# EAGLE design MicroBrute Noise add-on (EAGLE 7.6.0)
CNAME: Microbrute Addon; CREVISION: 2; DESIGNER: Gilberte / Mads Kjeldgaard
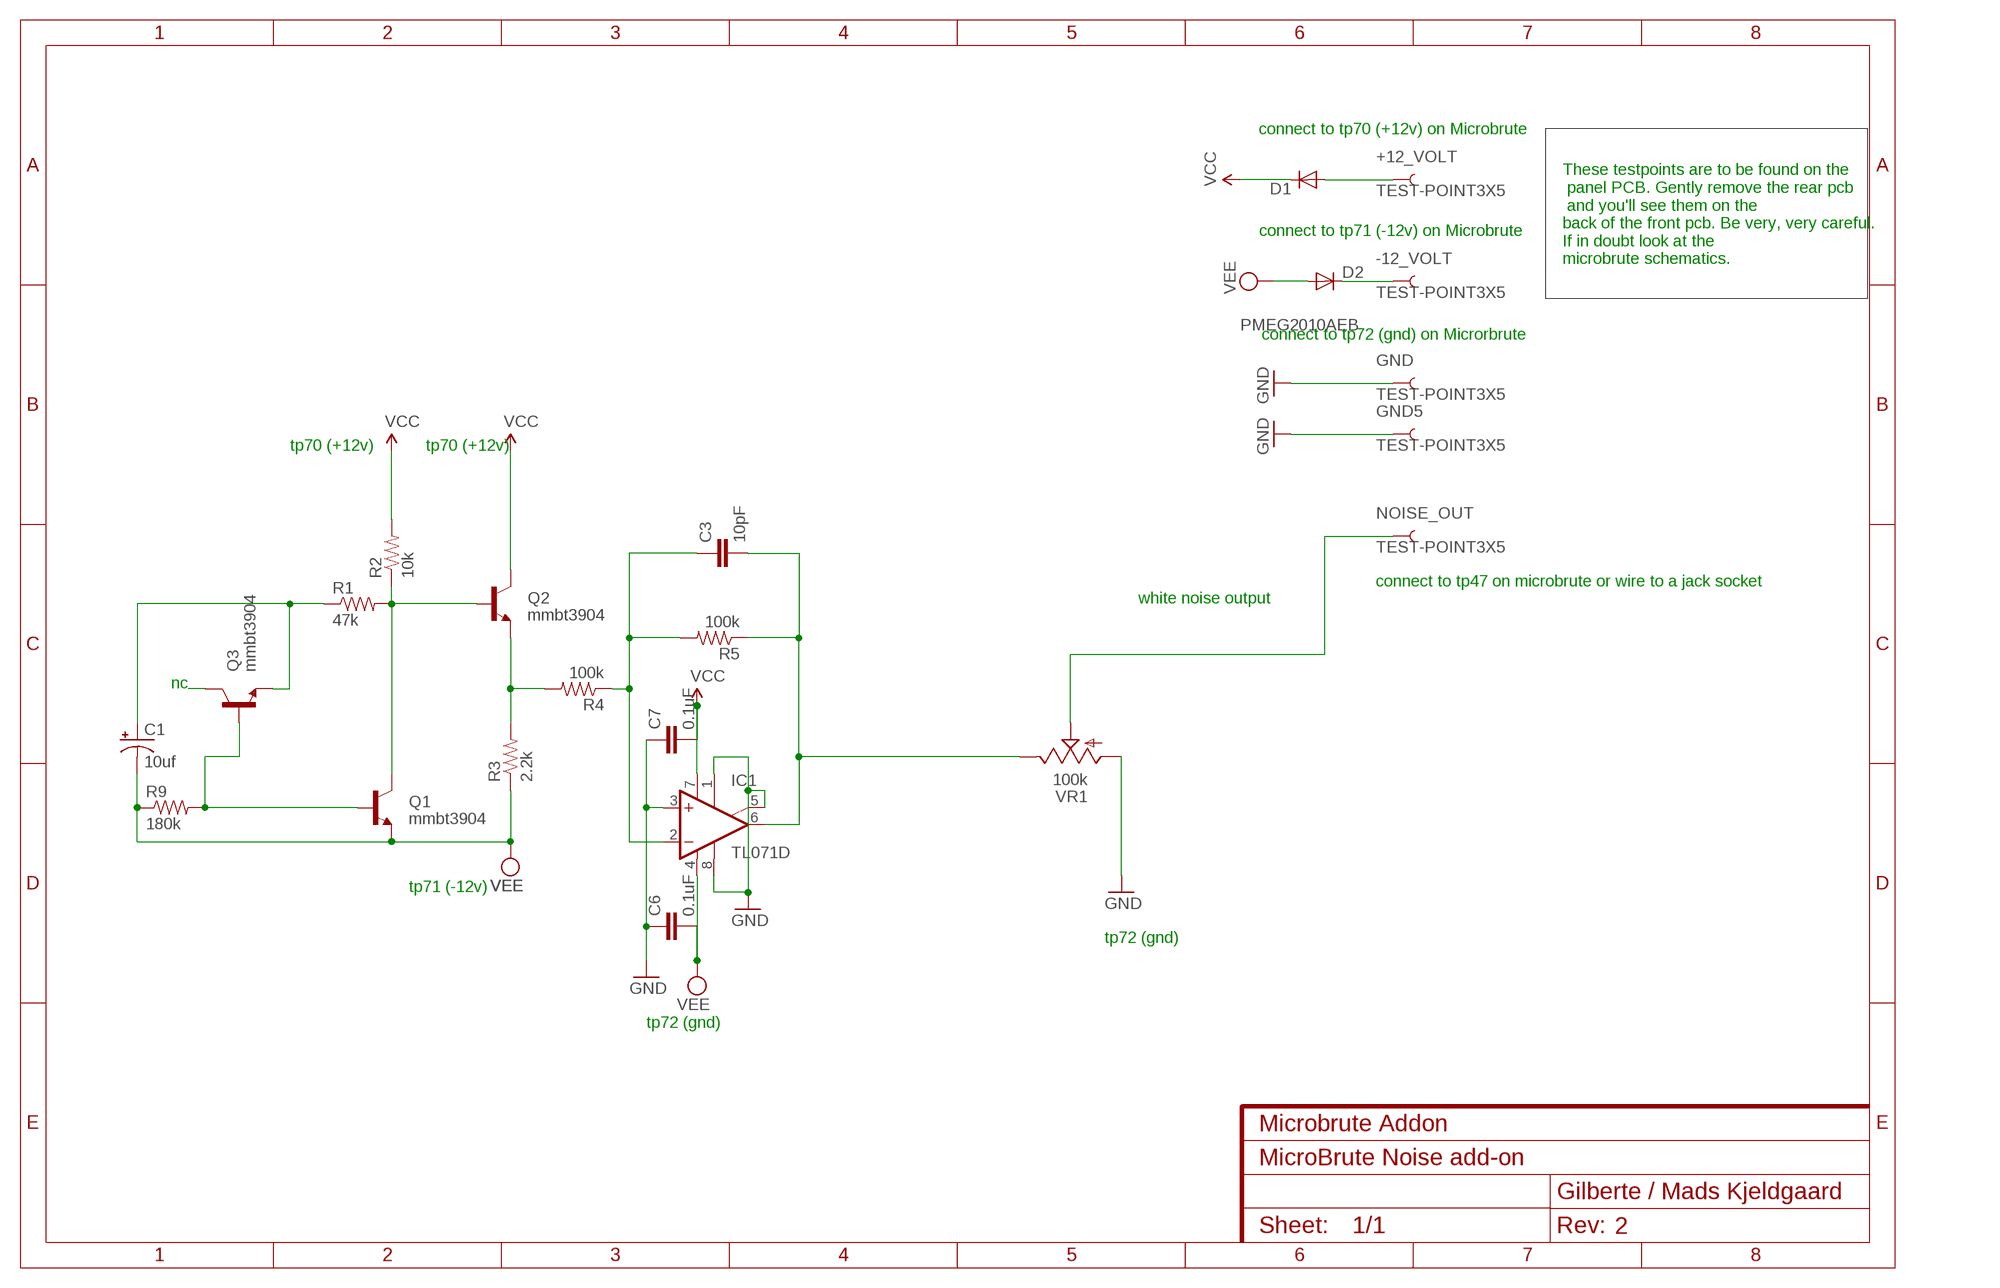
[diagram p0: schematic, sheet 1]

## Parts
+12_VOLT  TEST-POINT3X5  [PAD.03X.05]
-12_VOLT  TEST-POINT3X5  [PAD.03X.05]
C1  10uf  CAP_POLC  [PANASONIC_C]
C3  10pF  0.1UF-25V(+80/-20%)(0603)  [0603-CAP]
C6  0.1uF  0.1UF-25V(+80/-20%)(0603)  [0603-CAP]
C7  0.1uF  0.1UF-25V(+80/-20%)(0603)  [0603-CAP]
D1  PMEG2010AEB  DIODE-SOD523  [SOD523]
D2  PMEG2010AEB  DIODE-SOD523  [SOD523]
GND  TEST-POINT3X5  [PAD.03X.05]
GND5  TEST-POINT3X5  [PAD.03X.05]
IC1  TL071D  [SO08]
NOISE_OUT  TEST-POINT3X5  [PAD.03X.05]
Q1  mmbt3904  TRANSISTOR_NPNSOT23-3  [SOT23-3]
Q2  mmbt3904  TRANSISTOR_NPNSOT23-3  [SOT23-3]
Q3  mmbt3904  TRANSISTOR_NPNSOT23-3  [SOT23-3]
R1  47k  RESISTOR0603-RES  [0603-RES]
R2  10k  RESISTOR0603-RES  [0603-RES]
R3  2.2k  RESISTOR0603-RES  [0603-RES]
R4  100k  RESISTOR0603-RES  [0603-RES]
R5  100k  RESISTOR0603-RES  [0603-RES]
R9  180k  RESISTOR0603-RES  [0603-RES]
VR1  100k  9MM_SNAP-IN_POT_  [9MM_SNAP-IN_POT]

## Nets
GND: C6.1 C7.1 GND5.P$1 GND.P$1 IC1.1(ON1) IC1.3(+IN) IC1.5(ON2) IC1.8(OPT) VR1.1(A)
N$2: Q1.1(B) Q3.1(B) R9.2
N$3: C1.+ Q3.2(E) R1.1
N$4: Q2.2(E) R3.2 R4.2
N$5: Q3.3(C)
N$6: C3.2 IC1.6(OUT) R5.1 VR1.3(E)
N$8: +12_VOLT.P$1 D1.A
N$9: C3.1 IC1.2(-IN) R4.1 R5.2
N$10: -12_VOLT.P$1 D2.C
N$12: Q1.3(C) Q2.1(B) R1.2 R2.1
N$13: NOISE_OUT.P$1 VR1.2(S)
VCC: C7.2 D1.C IC1.7(V+) Q2.3(C) R2.2
VEE: C1.- C6.2 D2.A IC1.4(V-) Q1.2(E) R3.1 R9.1

## Notes on the sheet
- connect to tp70 (+12v) on Microbrute
- connect to tp71 (-12v) on Microbrute
- These testpoints are to be found on the
   panel PCB. Gently remove the rear pcb
   and you'll see them on the 
  back of the front pcb. Be very, very careful.
  If in doubt look at the 
  microbrute schematics.
- connect to tp72 (gnd) on Microrbrute
- tp70 (+12v) | tp70 (+12v)
- connect to tp47 on microbrute or wire to a jack socket
- white noise output
- nc
- tp71 (-12v)
- tp72 (gnd)
- tp72 (gnd)

## Library data of the parts
+12_VOLT -12_VOLT GND GND5 NOISE_OUT = SparkFun-Passives:TEST-POINT: Bare copper test points for troubleshooting or ICT
C1 = SparkFun-Passives:CAP_POL: Capacitor Polarized These are standard SMD and PTH capacitors. Normally 10uF, 47uF, and 100uF in electrolytic and tantalum varieties. Always verify the external diameter of the through hole cap, it varies with capacity, voltage, and manufacturer. The EIA devices should be standard.
C3 = SparkFun-Capacitors:0.1UF-25V(+80/-20%)(0603): CAP-00810 Ceramic Standard decoupling cap; PROD_ID: CAP-00810; VALUE: 0.1uF
C6 C7 = SparkFun-Capacitors:0.1UF-25V(+80/-20%)(0603): CAP-00810 Ceramic Standard decoupling cap; PROD_ID: CAP-00810
D1 D2 = diode:DIODE-: DIODE
IC1 = linear:TL071: OP AMP
Q1-Q3 = SparkFun-DiscreteSemi:TRANSISTOR_NPN: Generic NPN BJT MMBT2222A - TRANS-08049 (SOT-23, 1A 40V) MPSA42 - TRANS-09116 (SOT-23, 500mA 300V) MMBT5088LT1G - TRANS-11160 (SOT-23, 50 mA 30V) BC547 - COM-08928 <http://www.sparkfun.com/products/8928> (TO-92 45V 100mA) (1.Collector 2.Base 3.Emitter) 2N3904 - COM-00521 <http://www.sparkfun.com/products/521> (TO-92 40V 200mA) (1.Emitter 2.Base 3.Collector) P2N2222A - COM-12852 <http://www.sparkfun.com/products/12852> (TO-92 40V 600mA) (1.Collector 2.Base 3.Emitter); PROD_ID: TRANS-08049
R1-R5 R9 = SparkFun-Passives:RESISTOR: Resistor Basic schematic elements and footprints for 0603, 1206, and PTH resistors.
VR1 = MusicThingModular:9MM_SNAP-IN_POT: 9mm vertical snap-in pot, Alpha / Panasonic style

## Board
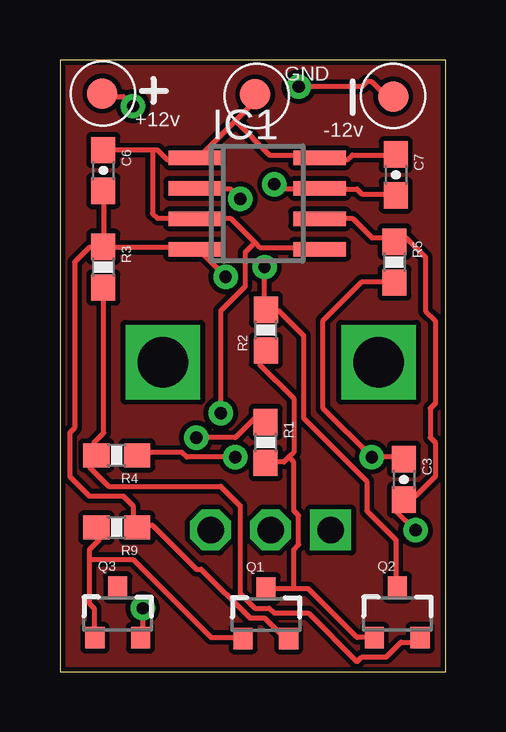
[diagram p1: board, top side]
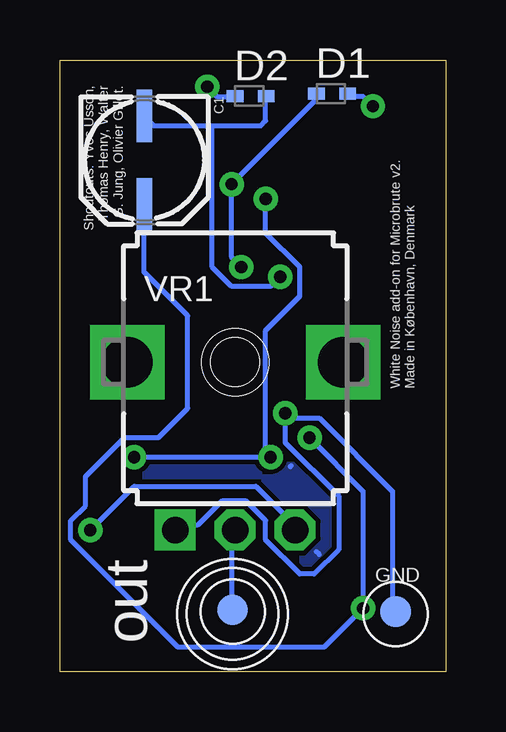
[diagram p2: board, bottom side, seen from below]

Size 16.1 x 25.5 mm. Coordinates in mm from the lower left corner, seen from the top.
Outline: 0,0 16.1,0 16.1,25.5 0,25.5 0,0
Copper layers (1*16): Top 0.035mm / dielectric 1.5mm / Bottom 0.035mm
Design rules "SparkFun": minimum track width 8mil, minimum drill 20mil, track to track 8mil, track to pad 8mil, pad to pad 8mil, via to via 8mil, smd to smd 8mil, copper to edge 8mil, drill to drill 8mil, minimum pad ring 12mil, minimum via ring 10mil, stop-mask expansion 4mil, vias tented up to drill 20mil, thermal gap 10mil

### Footprints (pad centres in the part's own frame; a part is rotated, then mirrored left to right if it is on the bottom)
PAD.03X.05 = smd 1.27 x 1.27: P$1 0,0
PANASONIC_C = smd 2.2 x 0.65: + 1.9,-0.2; - -1.8,-0.2
0603-CAP = smd 1.1 x 1: 1 -0.85,0; 2 0.85,0
SOD523 = smd 0.7 x 0.5: A 0.7,0; C -0.6,0
SO08 = smd 0.6 x 2.2: 1 -1.905,-2.6; 2 -0.635,-2.6; 3 0.635,-2.6; 4 1.905,-2.6; 5 1.905,2.6; 6 0.635,2.6; 7 -0.635,2.6; 8 -1.905,2.6
SOT23-3 = smd 0.8 x 0.9: 1 -0.95,-1; 2 0.95,-1; 3 0,1.1
0603-RES = smd 1.1 x 1: 1 -0.85,0; 2 0.85,0
9MM_SNAP-IN_POT = drill 1.1 square: 1 -2.5,-7 | drill 1.1 octagon: 2 0,-7; 3 2.5,-7 | drill 2.1 square: CHASSIS1 -4.5,0; CHASSIS2 4.5,0

### Placement (x,y rotation side)
+12_VOLT  1.77,24.1 0 top
-12_VOLT  13.9,23.97 0 top
C1  12.38,21.36 270 bottom
C3  14.35,8.01 270 top
C6  1.81,20.89 270 top
C7  14.01,20.71 270 top
D1  4.8,24.1 0 bottom
D2  8.2,24 0 bottom
GND  8.14,24.07 0 top
GND5  2.1,2.5 0 bottom
IC1  8.23,19.51 270 top
NOISE_OUT  8.91,2.57 0 bottom
Q1  8.59,2.38 0 top
Q2  14.07,2.41 0 top
Q3  2.41,2.41 0 top
R1  8.58,9.55 270 top
R2  8.58,14.24 90 top
R3  1.81,16.86 270 top
R4  2.37,9.02 180 top
R5  13.95,17.07 270 top
R9  2.37,6.01 180 top
VR1  8.79,12.9 0 bottom

### Tracks (layer width: path | path; a pad name or v marks a point on that pad's centre or on a via)
GND  (via drill 0.51)
  Top 0.203: C7.1 13.82,21.54 12.19,21.54 11.99,21.34 10.97,21.34 IC1.8 10.77,21.54 8.74,21.54 7.32,22.96 | 3.86,21.74 4.06,21.74 4.47,21.34 5.49,21.34 IC1.1 5.69,21.34 7.32,22.96 | 3.86,21.74 1.83,21.74 C6.1 | 7.32,22.96 8.13,23.77 8.13,23.98 GND.P$1 | 3.86,21.74 3.86,19.1 4.06,18.9 5.49,18.9 IC1.3 5.69,18.9 7.11,18.9 8.13,17.88 | 8.13,17.88 8.33,17.68 10.77,17.68 IC1.5 | v6.71,10.77 6.71,15.04 7.72,16.05 7.72,17.48 8.13,17.88
  Bottom 0.203: 6.71,10.57 6.71,9.55 4.47,7.32 4.47,5.08 5.49,4.06 6.1,4.06 7.52,5.49 7.52,6.3 8.33,7.11 9.35,7.11 10.36,6.1 11.18,6.1 VR1.1 | 6.71,10.57 5.28,10.57 2.23,7.52 2.23,2.64 GND5.P$1 | 6.71,10.57 v6.71,10.77
N$1
  pour Top: 0.1,0 0.1,25.5 16.2,25.5 16.2,25.4 16,25.4 16,0 0.2,0
N$2
  Top 0.203: 1.22,4.67 1.22,5.08 1.63,5.49 1.63,5.89 R9.2 | 1.22,4.67 1.22,2.85 1.42,2.64 1.42,1.42 Q3.1 | 1.22,4.67 3.05,4.67 6.3,1.42 7.52,1.42 Q1.1
N$3  (via drill 0.51)
  Top 0.203: v3.45,2.64 3.45,1.42 Q3.2 | v5.69,9.75 7.32,9.75 8.13,10.57 8.53,10.57 R1.1
  Bottom 0.203: v5.69,9.75 3.45,7.52 v3.45,2.64 5.08,1.02 11.18,1.02 15.65,5.49 15.65,6.3 15.04,6.91 15.04,8.13 13.41,9.75 11.99,9.75 10.77,10.97 10.77,14.83 12.6,16.66 12.6,19.3 C1.+
N$4
  Top 0.203: Q2.2 14.83,1.22 14.22,1.22 13.61,0.61 12.6,0.61 12.39,0.41 10.36,2.44 8.94,2.44 8.74,2.64 8.13,2.64 7.52,3.25 7.52,6.91 6.71,7.72 2.03,7.72 1.22,8.53 1.22,8.74 1.42,8.94 R4.2 1.42,9.14 1.42,9.55 1.83,9.96 1.83,15.85 R3.2
N$6  (via drill 0.51)
  Top 0.203: IC1.6 10.97,18.9 12.19,18.9 13.01,18.09 13.82,18.09 R5.1 14.02,18.09 14.43,18.09 15.24,17.27 15.24,15.04 15.65,14.63 15.65,11.18 15.44,10.97 15.44,9.75 15.65,9.55 15.65,8.13 14.83,7.32 14.43,7.32 C3.2 14.22,7.11 14.02,6.91 14.02,6.71 v14.83,5.89
  Bottom 0.203: v14.83,5.89 13.01,7.72 7.92,7.72 6.3,6.1 VR1.3
N$7
  Bottom 0.203: 5.28,4.88 5.41,5 | 6.5,8.53 6.46,8.58
  pour Bottom: 0,0 16.1,0 16.1,25.5 0,25.5
N$8  (via drill 0.51)
  Top 0.203: v3.05,23.57 2.64,23.98 1.83,23.98 +12_VOLT.P$1
  Bottom 0.203: v3.05,23.57 3.45,23.98 4.06,23.98 D1.A
N$9  (via drill 0.51)
  Top 0.203: v7.32,8.94 5.28,8.94 5.08,9.14 3.25,9.14 R4.1 | C3.1 14.22,8.94 v13.01,8.94 10.97,10.97 10.97,14.63 12.6,16.26 13.82,16.26 R5.2 | v7.52,19.71 7.11,20.12 5.69,20.12 IC1.2
  Bottom 0.203: v13.01,8.94 7.52,8.94 | v7.52,19.71 7.52,18.29 6.1,16.87 6.1,15.65 7.52,14.22 7.52,8.94 | 7.52,8.94 v7.32,8.94
N$10  (via drill 0.51)
  Top 0.203: v9.96,24.38 12.6,24.38 12.8,24.59 13.01,24.59 13.82,23.77 -12_VOLT.P$1
  Bottom 0.203: v9.96,24.38 9.55,23.98 8.94,23.98 D2.C
N$12
  Top 0.203: 9.55,8.94 9.75,9.14 9.75,11.38 8.33,12.8 8.33,13.01 8.53,13.21 R2.1 | 9.55,8.94 9.35,8.74 8.74,8.74 R1.2 | 9.75,3.45 10.36,3.45 12.39,1.42 13.01,1.42 Q2.1 | 9.75,3.45 8.74,3.45 Q1.3 | 9.55,8.94 9.75,8.74 9.75,6.71 9.96,6.5 9.96,5.28 9.75,5.08 9.75,3.45
N$13
  Bottom 0.203: NOISE_OUT.P$1 8.94,2.64 8.94,5.89 VR1.2
VCC  (via drill 0.51)
  Top 0.203: v8.94,20.32 9.14,20.32 9.35,20.12 10.77,20.12 IC1.7 10.97,20.12 12.39,20.12 12.6,19.91 13.82,19.91 C7.2 | Q2.3 14.02,3.66 14.02,5.49 12.8,6.71 12.8,7.92 10.16,10.57 10.16,14.02 9.14,15.04 8.74,15.04 R2.2 8.53,15.24 v8.53,16.87
  Bottom 0.203: D1.C 5.49,23.98 5.49,23.77 v8.94,20.32 8.94,17.27 v8.53,16.87
VEE  (via drill 0.51)
  Top 0.203: Q1.2 9.35,1.42 8.53,2.23 7.92,2.23 5.89,4.27 5.69,4.27 3.86,6.1 3.25,6.1 R9.1 3.05,6.1 3.05,6.91 2.64,7.32 1.22,7.32 0.41,8.13 0.41,9.96 0.61,10.16 0.61,17.07 1.22,17.68 1.63,17.68 R3.1 | R3.1 1.83,17.88 1.83,19.91 C6.2 | R3.1 1.83,17.68 5.49,17.68 IC1.4 5.69,17.68 v6.91,16.46
  Bottom 0.203: 9.75,22.76 12.19,22.76 12.6,23.16 C1.- | 9.75,22.76 7.72,22.76 7.52,22.96 7.52,23.98 D2.A | 9.75,22.76 9.75,16.87 8.94,16.05 7.32,16.05 v6.91,16.46

### Text on the board
tNames: GND | +12v | -12v
bNames: Shoutouts: Yves Usson, / Thomas Henry, Walter / G. Jung, Olivier Gillet. | White Noise add-on for Microbrute v2. / Made in København, Denmark | GND | out